# Altium project Instrumentation Amplifier.PrjPcb
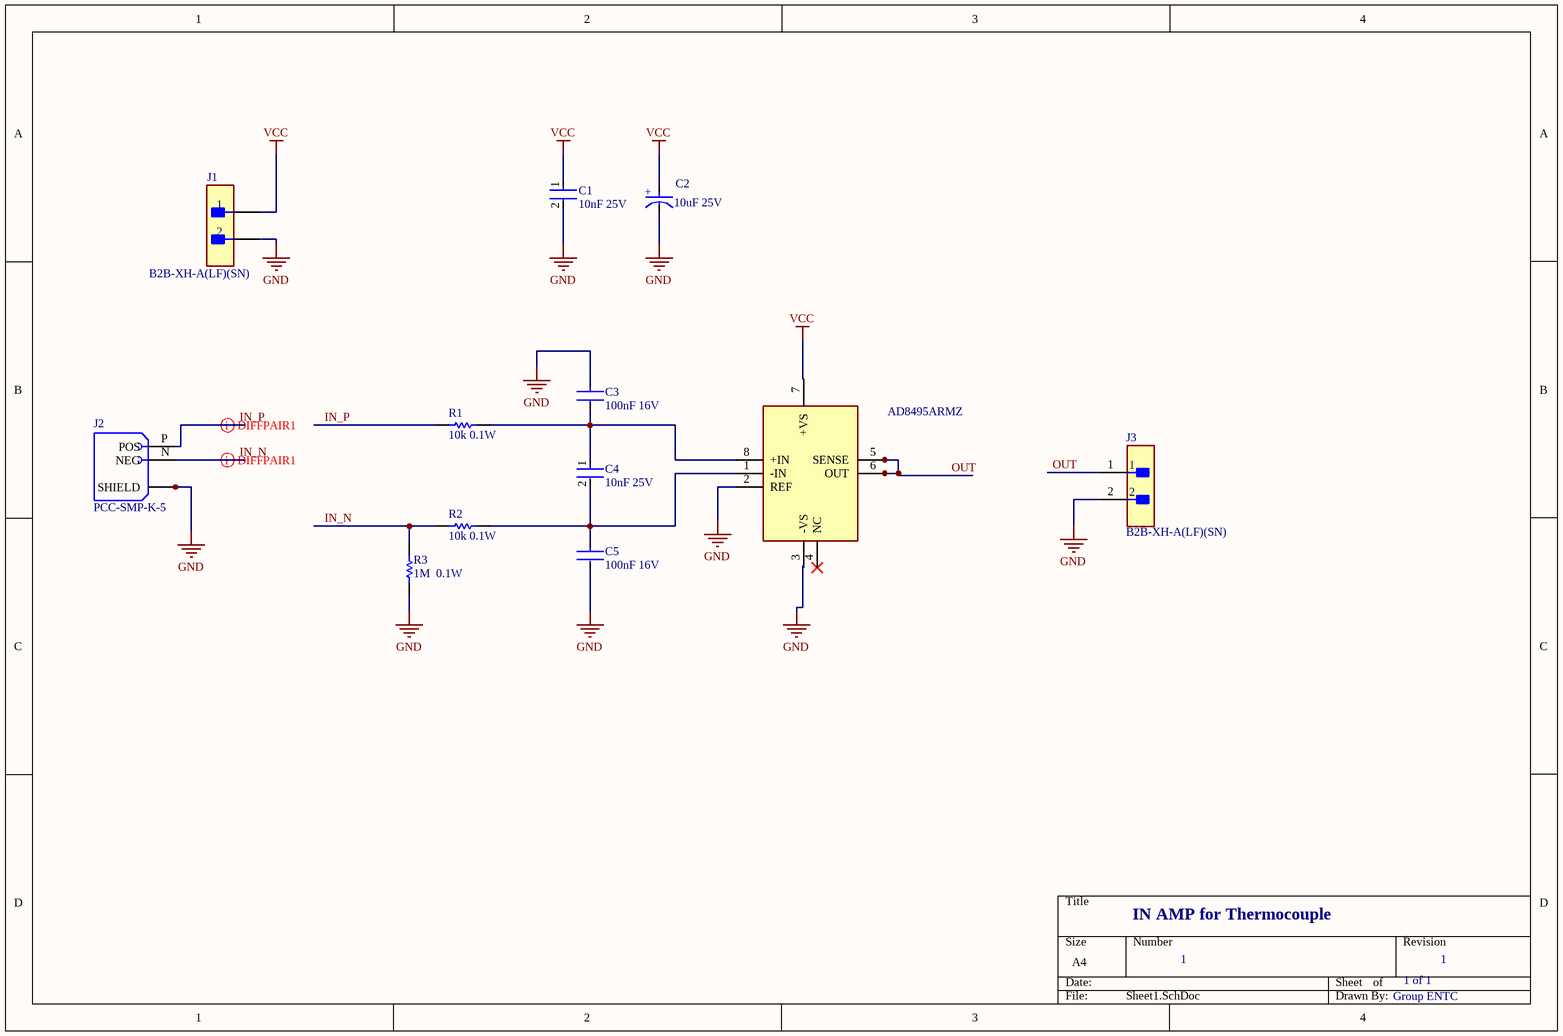
[diagram p0: Sheet1.SchDoc]
1 sheet, 12 parts. Net scope: global (net labels, ports and power ports of the same name join across sheets).
Board file: PCB1.PcbDoc

## Sheet Sheet1.SchDoc
size A4; SheetNumber: 1; SheetTotal: 1

### Parts
C1  10nF 25V  [FP-0603-L_1_6_0_15-W_0_81-IPC_C]
C2  10uF 25V  [FP-T491D-MFG]
C3  100nF 16V  [FP-C1005-050-0_05-MFG]
C4  10nF 25V  [FP-0603-L_1_6_0_15-W_0_81-IPC_C]
C5  100nF 16V  [FP-C1005-050-0_05-MFG]
IC?  AD8495ARMZ  [SOP65P490X110-8N]
J1  B2B-XH-A(LF)(SN)  [FP-B2B-XH-A_LF_SN-MFG]
J2  PCC-SMP-K-5  [OMEGA_PCC-SMP-K-5]
J3  B2B-XH-A(LF)(SN)  [FP-B2B-XH-A_LF_SN-MFG]
R1  10k 0.1W  [RESC2013X60X35NL10T20]
R2  10k 0.1W  [RESC2013X60X35NL10T20]
R3  1M  0.1W  [RESC1608X55X25LL10T15]

### Nets
GND: C1.2 C2.1(C) C3.1 C5.2 IC?.2(REF) IC?.3(-VS) J1.2 J2.S1(SHIELD) J2.S2(SHIELD) J3.2 R3.1
VCC: C1.1 C2.2(A) IC?.7(+VS) J1.1
IN_N: J2.N(NEG) R2.1 R3.2
IN_P: J2.P(POS) R1.1
OUT: IC?.5(SENSE) IC?.6(OUT) J3.1
NetC3_2: C3.2 C4.1 IC?.8(+IN) R1.2
NetC4_2: C4.2 C5.1 IC?.1(-IN) R2.2

Not connected (* = marked no-connect by the designer): IC? 4(NC)*

### Layout directives
differential pair: IN_N, IN_P

### Notes on the sheet
- IN AMP for Thermocouple
- 1
- 1 of 1
- Group ENTC
- (in symbol CMP-2000-07200-2) +

### Library data of the parts
C1 C4 = CMP-2006-04155-2: General Purpose Ceramic Capacitor, 0603, 10nF, 10%, X7R, 15%, 25V; Voltage: 50V; Depth: 0.81mm; Dielectric: X7R; Number of Pins: 2; Packaging: Tape and Reel; Voltage Rating (DC): 25V; Width: 0.032inch; Radiation Hardening: No; Length: 1.6mm; Case/Package: 0603; Capacitance: 10nF; Thickness: 0.035inch; Series: -; Tolerance: 10%; Case Code (Imperial): 0603; Construction: Flat; Max Operating Temperature: 125°C; Package Quantity: 1; Termination: SMD/SMT; Voltage Rating: 25V; Contact Plating: Tin; RoHS Compliant: Yes; Lead Free: Lead Free; Min Operating Temperature: -55°C; REACH SVHC: No SVHC; Case Code (Metric): 1608; Mount: Surface Mount
C2 = CMP-2000-07200-2: CAP TANT 10UF 10% 25V 2917; Tolerance: 20%; Life (Hours): 2000Hour; Dielectric Material: Tantalum; Dissipation Factor: 6%; Leakage Current: 2.5uA; Ripple Current: 387mA; Polarity: Polar; ESR (Equivalent Series Resistance): 1R; Voltage: 25V; Capacitance: 10uF; Voltage Rating: 25V; Voltage Rating (DC): 25V; Depth: 4.3mm; Mount: Surface Mount; Length: 7.3mm; Termination: SMD/SMT; Radiation Hardening: No; Max Operating Temperature: 125°C; REACH SVHC: No SVHC; Height: 2.8mm; Package Quantity: 1; Packaging: Tape and Reel; Case Code (Imperial): 2917; Width: 4.3mm; Min Operating Temperature: -55°C; Features: General Purpose; Case Code (Metric): 7343; Height - Seated (Max): 0.122inch; Number of Pins: 2; Lead Free: Lead Free; Case/Package: 2917
C3 C5 = CMP-08246-004182-1: Multilayer Ceramic Capacitors 100nF ±10% 16V X7R SMD 0402; Voltage: 16V; Depth: 0.5mm; Dielectric Material: Ceramic; Lead Free: Lead Free; Number of Pins: 2; Mount: Surface Mount; Radiation Hardening: No; Case/Package: 0402; Voltage Rating: 16V; Capacitance: 100nF; Dielectric: X7R; Min Operating Temperature: -55°C; RoHS Compliant: Yes; Tolerance: 10%; Voltage Rating (DC): 16V; Max Operating Temperature: 125°C; Case Code (Metric): 1005; Height: 0.5mm; Thickness: 0.022inch; Package Quantity: 1; Packaging: Tape and Reel; Termination: SMD/SMT; Construction: Flat; Resistor Type: Ceramic; Length: 1mm; Case Code (Imperial): 0402; Width: 0.02inch; Series: C; Weight: 2.3E-05oz
IC? = AD8495ARMZ: Integrated Circuit; Manufacturer_Name: Analog Devices; Datasheet Link: http://componentsearchengine.com/Datasheets/1/AD8495ARMZ.pdf; Height: 1.1mm; Manufacturer_Part_Number: AD8495ARMZ; Mouser Part Number: 584-AD8495ARMZ; Mouser Price/Stock: https://www.mouser.co.uk/ProductDetail/Analog-Devices/AD8495ARMZ?qs=%2FtpEQrCGXCzFkbQFVK6T6w%3D%3D; Arrow Part Number: AD8495ARMZ; Arrow Price/Stock: https://www.arrow.com/en/products/ad8495armz/analog-devices?region=europe
J1 J3 = CMP-2000-05888-3: CONN HEADER VERT 2POS 2.5MM; Current Rating: 3A; Voltage Rating: 250V; Number of Contacts: 2; Contact Resistance: 20mR; Wire/Cable Gauge: 22AWG; Insulation Resistance: 1GR; Connector Type: Male Pin; Packaging: Bulk; Contact Material: Brass; Lead Free: Lead Free; Orientation: Straight; Contact Plating: Tin; Max Current Rating: 3A; Termination: Solder; Fastening Type: Detent; Depth: 5.75mm; Housing Material: Polyamide; REACH SVHC: No SVHC; Series: XH; Voltage Rating (AC): 250V; Number of Positions: 2; Color: Natural; Contact Type: Male Pin; Max Voltage Rating (DC): 250V; Pitch: 2.5mm; Lead Pitch: 2.5mm; Mount: Through Hole; Max Operating Temperature: 85°C; Length: 7.4mm; Max Voltage Rating (AC): 250V; Min Operating Temperature: -25°C; Number of Rows: 1; Housing Color: White
J2 = PCC-SMP-K-5: Thermocouple Conn, K Type, Rcpt, Pk 5; MF: Omega Engineering; MP: PCC-SMP-K-5; Check_prices: https://www.snapeda.com/parts/PCC-SMP-K-5/Omega%20Engineering/view-part/2886965/?ref=eda; Package: None; SnapEDA_Link: https://www.snapeda.com/parts/PCC-SMP-K-5/Omega%20Engineering/view-part/2886965/?ref=snap; Value: *; Price: None; Availability: No availability data
R1 R2 = CMP-1659-00013-4: Chip Resistor, 10 KOhm, +/- 1%, 0.125 W, -55 to 155 degC, 0805 (2012 Metric), RoHS, Tape and Reel; Manufacturer: Yageo; Voltage Rating: 150 V; Mount: Surface Mount; ComponentLink1Description: Manufacturer URL; ComponentLink2URL: http://www.yageo.com/documents/recent/PYu-RC_Group_51_RoHS_L_04.pdf; Pins: 2; Length: 2 mm; Min Operating Temperature: -55 degC; Height: 0.5 mm; Mounting Technology: Surface Mount; RoHSCompliant: true; REACH SVHC: No SVHC; ComponentLink1URL: http://www.yageo.com/; Max Operating Temperature: 155 degC; PackageReference: 0805; DatasheetVersion: Rev. 4, 02/2016; Package Quantity: 5000; Packaging: Tape and Reel; ComponentLink2Description: Datasheet; PackageDescription: 2-Pin Surface Mounted Device, Body 2 x 1.25 mm
R3 = CMP-1659-00056-1: Chip Resistor, 1 MOhm, +/- 1%, 100 mW, -55 to 155 degC, 0603 (1608 Metric), RoHS, Tape and Reel; Voltage Rating (DC): 25 V; Tolerance: 20%; Case\Package: Radial; Capacitance: 1 mF; Min Operating Temperature: -40 degC; PackageDescription: 2-Pin Surface Mount Device, Body 1.6 x 0.8 mm; ComponentLink1Description: Manufacturer URL; Radiation Hardening: No; DatasheetVersion: Rev. 4, 02/2016; REACH SVHC: No SVHC; Length: 20 mm; Max Operating Temperature: 85 degC; Diameter: 10 mm; Packaging: Bulk; Package Quantity: 200; PackageReference: 0603; Mount: Through Hole; ComponentLink1URL: http://www.yageo.com/; ComponentLink2URL: http://www.yageo.com/documents/recent/PYu-RC_Group_51_RoHS_L_04.pdf; ComponentLink2Description: Datasheet; Width: 0 inch; Lead Pitch: 5 mm; RoHSCompliant: true; Voltage Rating: 25 V; Height: 20 mm